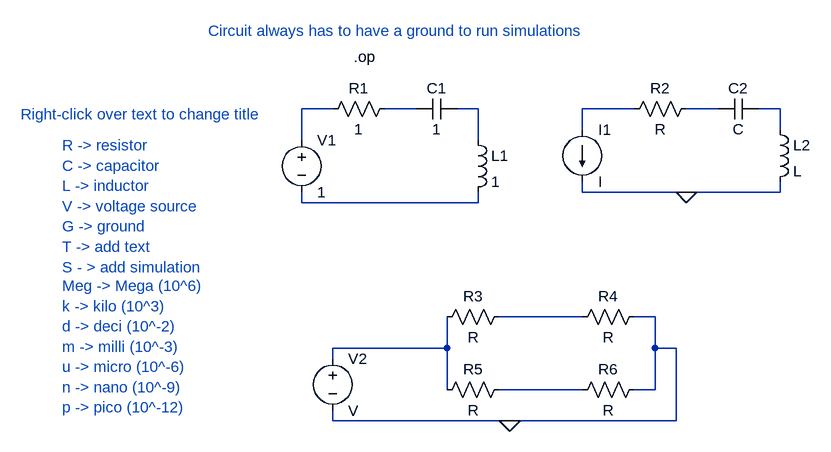
[diagram p0: schematic LTSPICE_Lesson2_Schematics.asc]
LTSPICE_Lesson2_Schematics.asc, the LTspice schematic file:
Version 4
SHEET 1 1076 724
WIRE 0 144 -48 144
WIRE 128 144 80 144
WIRE 224 144 192 144
WIRE 464 144 384 144
WIRE 592 144 544 144
WIRE 688 144 656 144
WIRE 384 176 384 144
WIRE 688 176 688 144
WIRE -48 192 -48 144
WIRE 224 192 224 144
WIRE 384 272 384 256
WIRE 544 272 384 272
WIRE 688 272 688 256
WIRE 688 272 544 272
WIRE -48 288 -48 272
WIRE 224 288 224 272
WIRE 224 288 -48 288
WIRE 384 464 256 464
WIRE 496 464 464 464
WIRE 176 512 176 464
WIRE 176 512 0 512
WIRE 496 512 496 464
WIRE 528 512 496 512
WIRE 0 528 0 512
WIRE 176 576 176 512
WIRE 384 576 256 576
WIRE 496 576 496 512
WIRE 496 576 464 576
WIRE 0 624 0 608
WIRE 272 624 0 624
WIRE 528 624 528 512
WIRE 528 624 272 624
FLAG 544 272 0
FLAG 272 624 0
SYMBOL voltage -48 176 R0
WINDOW 123 0 0 Left 0
WINDOW 39 0 0 Left 0
SYMATTR InstName V1
SYMATTR Value 1
SYMBOL res 96 128 R90
WINDOW 0 0 56 VBottom 2
WINDOW 3 32 56 VTop 2
SYMATTR InstName R1
SYMATTR Value 1
SYMBOL cap 192 128 R90
WINDOW 0 0 32 VBottom 2
WINDOW 3 32 32 VTop 2
SYMATTR InstName C1
SYMATTR Value 1
SYMBOL ind 208 176 R0
SYMATTR InstName L1
SYMATTR Value 1
SYMBOL current 384 176 R0
SYMATTR InstName I1
SYMBOL res 560 128 R90
WINDOW 0 0 56 VBottom 2
WINDOW 3 32 56 VTop 2
SYMATTR InstName R2
SYMBOL cap 656 128 R90
WINDOW 0 0 32 VBottom 2
WINDOW 3 32 32 VTop 2
SYMATTR InstName C2
SYMBOL ind 672 160 R0
SYMATTR InstName L2
SYMBOL voltage 0 512 R0
SYMATTR InstName V2
SYMBOL res 272 448 R90
WINDOW 0 0 56 VBottom 2
WINDOW 3 32 56 VTop 2
SYMATTR InstName R3
SYMBOL res 480 448 R90
WINDOW 0 0 56 VBottom 2
WINDOW 3 32 56 VTop 2
SYMATTR InstName R4
SYMBOL res 272 560 R90
WINDOW 0 0 56 VBottom 2
WINDOW 3 32 56 VTop 2
SYMATTR InstName R5
SYMBOL res 480 560 R90
WINDOW 0 0 56 VBottom 2
WINDOW 3 32 56 VTop 2
SYMATTR InstName R6
TEXT -416 200 Left 2 ;R -> resistor\nC -> capacitor \nL -> inductor\nV -> voltage source\nG -> ground\nT -> add text\nS - > add simulation
TEXT 32 64 Left 2 !.op
TEXT -192 24 Left 2 ;Circuit always has to have a ground to run simulations
TEXT -416 416 Left 2 ;Meg -> Mega (10^6)\nk -> kilo (10^3)\nd -> deci (10^-2)\nm -> milli (10^-3)\nu -> micro (10^-6)\nn -> nano (10^-9)\np -> pico (10^-12)
TEXT -480 152 Left 2 ;Right-click over text to change title

The netlist it stands for:
* LTSPICE_Lesson2_Schematics.asc
V1 N001 N007 1
R1 N002 N001 1
C1 N003 N002 1
L1 N003 N007 1
I1 N004 0 I
R2 N005 N004 R
C2 N006 N005 C
L2 N006 0 L
V2 N009 0 V
R3 N008 N009 R
R4 0 N008 R
R5 N010 N009 R
R6 0 N010 R
* R -> resistor
* C -> capacitor
* L -> inductor
* V -> voltage source
* G -> ground
* T -> add text
* S - > add simulation
.op
* Circuit always has to have a ground to run simulations
* Meg -> Mega (10^6)
* k -> kilo (10^3)
* d -> deci (10^-2)
* m -> milli (10^-3)
* u -> micro (10^-6)
* n -> nano (10^-9)
* p -> pico (10^-12)
* Right-click over text to change title
.backanno
.end